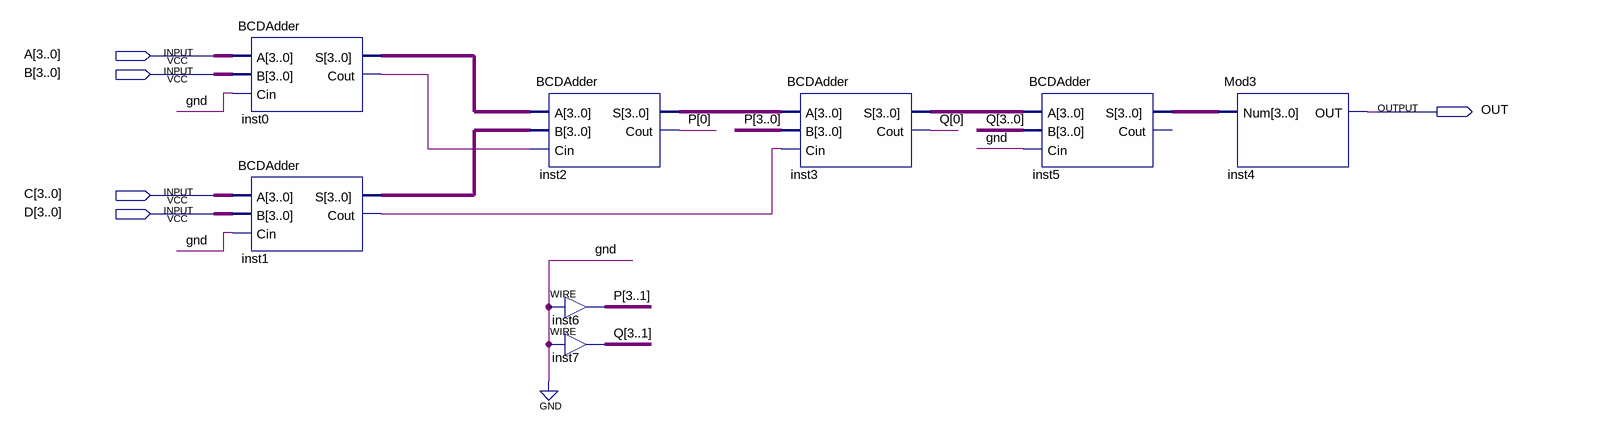
[diagram p0: schematic sheet]
// Quartus schematic FourDigitMod3.bdf as structural Verilog: 8 symbols, 5 pins
module FourDigitMod3 (
  input  [3:0] A,
  input  [3:0] B,
  input  [3:0] C,
  input  [3:0] D,
  output OUT
);

  wire inst0_cout, inst1_cout;
  wire [3:0] inst0_s, inst1_s, inst2_s, inst3_s, inst5_s, P, Q;

  BCDAdder inst0 (.A(A), .B(B), .Cin(1'b0), .S(inst0_s), .Cout(inst0_cout));
  BCDAdder inst1 (.A(C), .B(D), .Cin(1'b0), .S(inst1_s), .Cout(inst1_cout));
  BCDAdder inst2 (.A(inst0_s), .B(inst1_s), .Cin(inst0_cout), .S(inst2_s), .Cout(P[0]));
  assign P[3:1] = 3'b000;  // WIRE inst6
  assign Q[3:1] = 3'b000;  // WIRE inst7
  BCDAdder inst3 (.A(inst2_s), .B(P), .Cin(inst1_cout), .S(inst3_s), .Cout(Q[0]));
  BCDAdder inst5 (.A(inst3_s), .B(Q), .Cin(1'b0), .S(inst5_s));  // open: Cout
  Mod3 inst4 (.Num(inst5_s), .OUT(OUT));
endmodule
